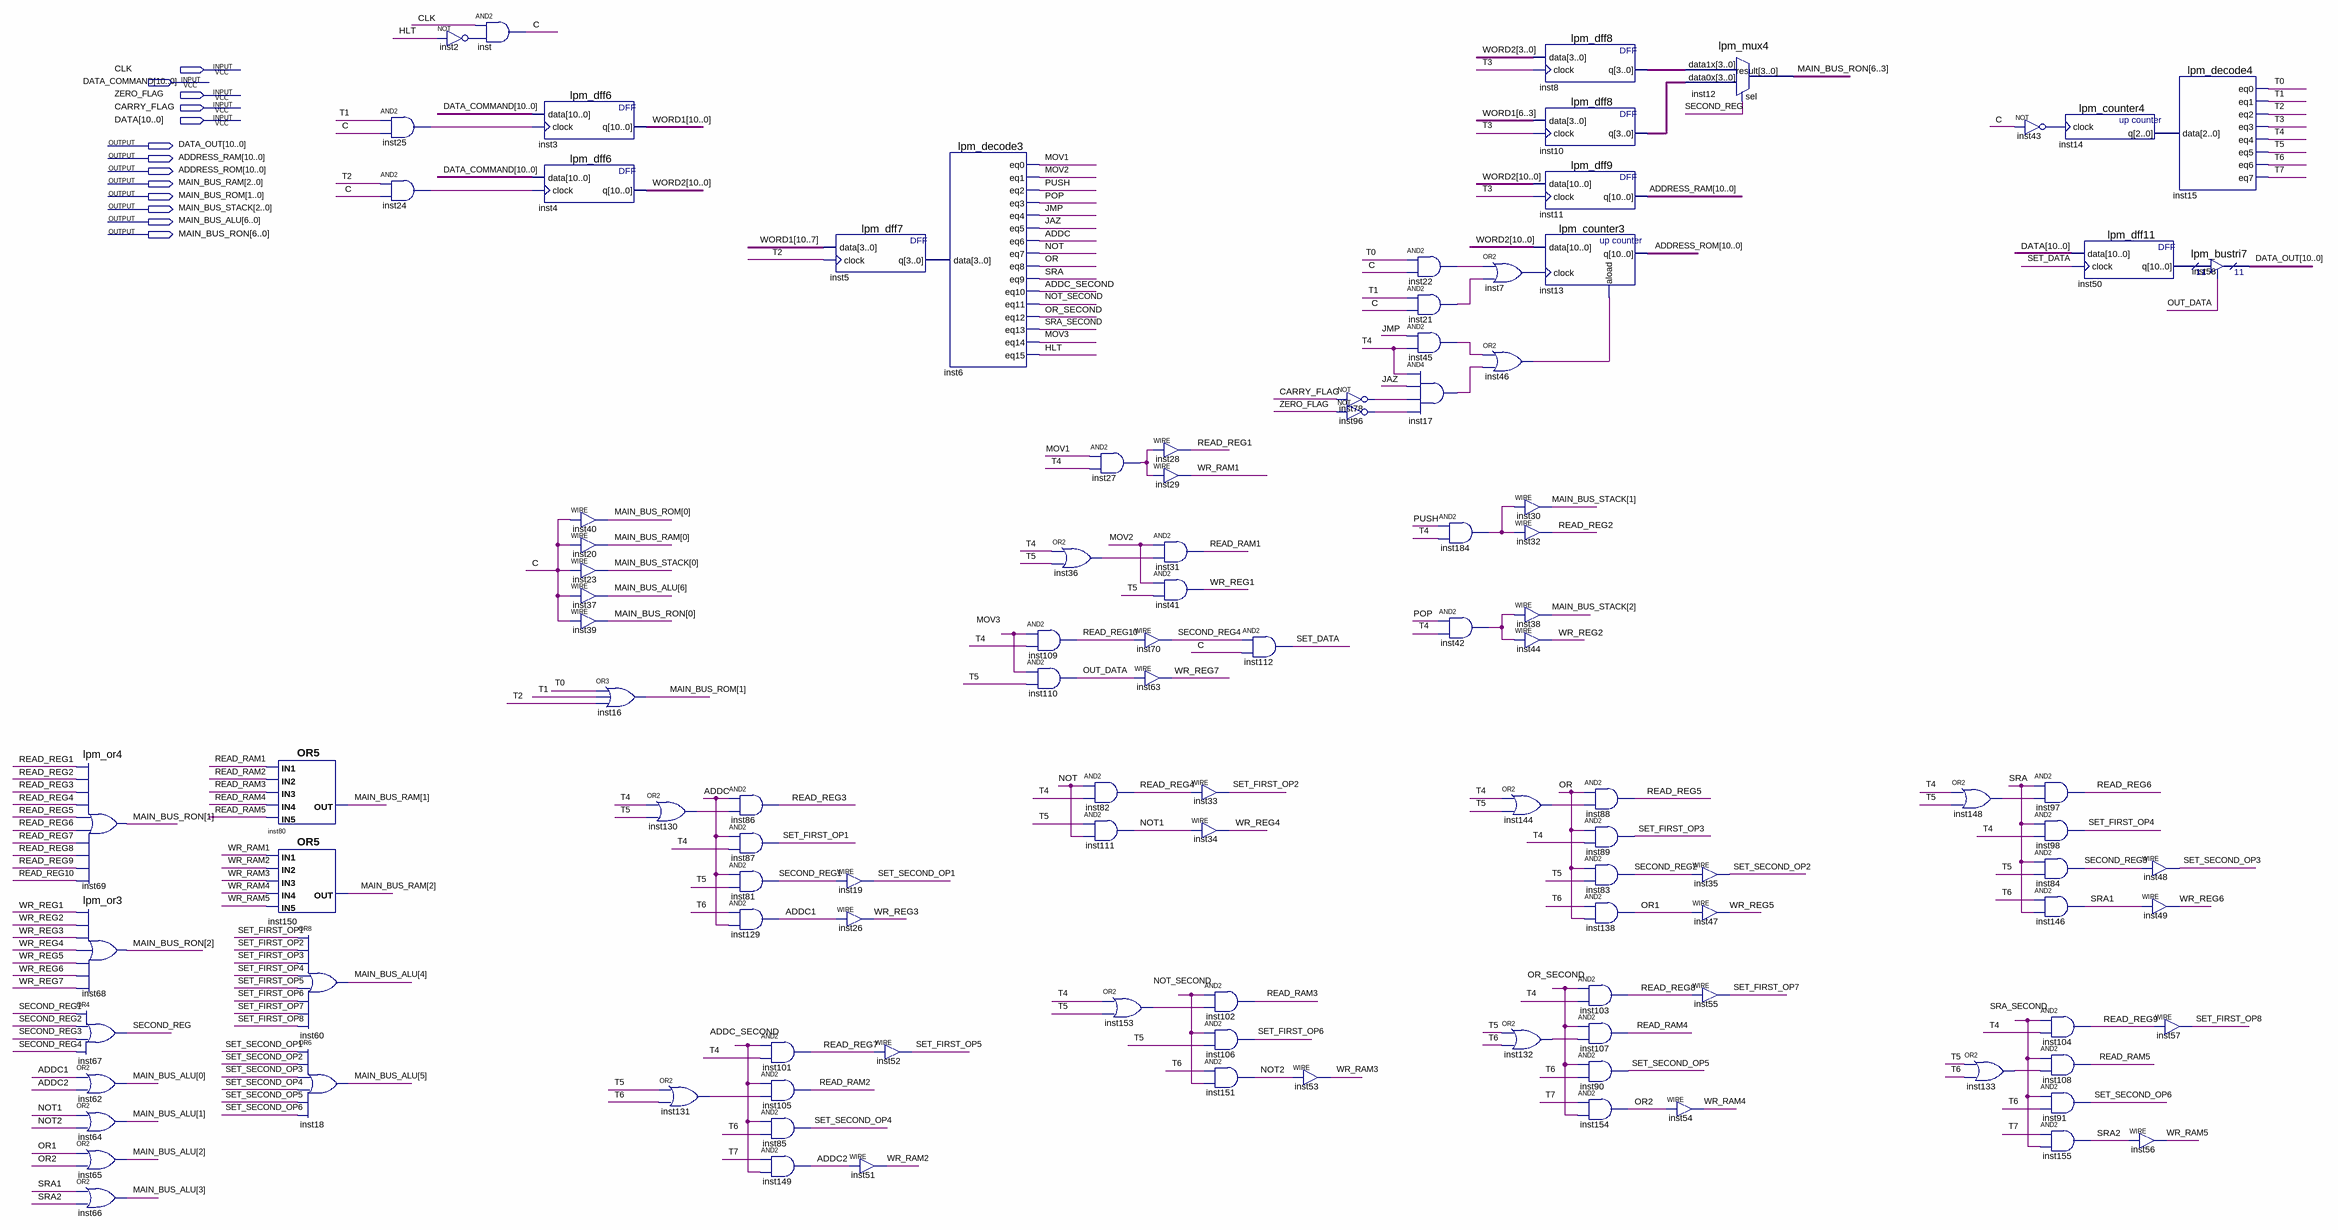
[diagram p0: schematic sheet]
// Quartus schematic CUBlock.bdf as structural Verilog: 111 symbols, 13 pins
module CUBlock (
  input  CLK,
  input  [10:0] DATA_COMMAND,
  input  ZERO_FLAG,
  input  CARRY_FLAG,
  input  [10:0] DATA,
  output [10:0] DATA_OUT,
  output [10:0] ADDRESS_RAM,
  output [10:0] ADDRESS_ROM,
  output [2:0] MAIN_BUS_RAM,
  output [1:0] MAIN_BUS_ROM,
  output [2:0] MAIN_BUS_STACK,
  output [6:0] MAIN_BUS_ALU,
  output [6:0] MAIN_BUS_RON
);

  wire ADDC, ADDC1, ADDC2, ADDC_SECOND, C, HLT, inst2_out, inst7_out, inst17_out, inst21_out, inst22_out,
       inst24_out, inst25_out, inst27_out, inst36_out, inst42_out, inst43_out, inst45_out, inst46_out,
       inst78_out, inst96_out, inst130_out, inst131_out, inst132_out, inst133_out, inst144_out, inst148_out,
       inst153_out, inst184_out, JAZ, JMP, MOV1, MOV2, MOV3, NOT, NOT1, NOT2, NOT_SECOND, OR, OR1, OR2,
       OR_SECOND, OUT_DATA, POP, PUSH, READ_RAM1, READ_RAM2, READ_RAM3, READ_RAM4, READ_RAM5, READ_REG1,
       READ_REG2, READ_REG3, READ_REG4, READ_REG5, READ_REG6, READ_REG7, READ_REG8, READ_REG9, READ_REG10,
       SECOND_REG, SECOND_REG1, SECOND_REG2, SECOND_REG3, SECOND_REG4, SET_DATA, SET_FIRST_OP1,
       SET_FIRST_OP2, SET_FIRST_OP3, SET_FIRST_OP4, SET_FIRST_OP5, SET_FIRST_OP6, SET_FIRST_OP7,
       SET_FIRST_OP8, SET_SECOND_OP1, SET_SECOND_OP2, SET_SECOND_OP3, SET_SECOND_OP4, SET_SECOND_OP5,
       SET_SECOND_OP6, SRA, SRA1, SRA2, SRA_SECOND, T0, T1, T2, T3, T4, T5, T6, T7, WR_RAM1, WR_RAM2,
       WR_RAM3, WR_RAM4, WR_RAM5, WR_REG1, WR_REG2, WR_REG3, WR_REG4, WR_REG5, WR_REG6, WR_REG7;
  wire [2:0] inst14_q;
  wire [3:0] inst5_q, inst8_q, inst10_q;
  wire [10:0] inst50_q, WORD1, WORD2;

  lpm_or4 inst69 (
    .data0(READ_REG1), .data1(READ_REG2), .data2(READ_REG3), .data3(READ_REG4), .data4(READ_REG5),
    .data5(READ_REG6), .data6(READ_REG7), .data7(READ_REG8), .data8(READ_REG9), .data9(READ_REG10),
    .result(MAIN_BUS_RON[1]));
  lpm_or3 inst68 (
    .data0(WR_REG1), .data1(WR_REG2), .data2(WR_REG3), .data3(WR_REG4), .data4(WR_REG5), .data5(WR_REG6),
    .data6(WR_REG7), .result(MAIN_BUS_RON[2]));
  or inst67 (SECOND_REG, SECOND_REG1, SECOND_REG2, SECOND_REG3, SECOND_REG4);
  or inst62 (MAIN_BUS_ALU[0], ADDC1, ADDC2);
  or inst64 (MAIN_BUS_ALU[1], NOT1, NOT2);
  or inst65 (MAIN_BUS_ALU[2], OR1, OR2);
  or inst66 (MAIN_BUS_ALU[3], SRA1, SRA2);
  or inst80 (MAIN_BUS_RAM[1], READ_RAM1, READ_RAM2, READ_RAM3, READ_RAM4, READ_RAM5);
  or inst150 (MAIN_BUS_RAM[2], WR_RAM1, WR_RAM2, WR_RAM3, WR_RAM4, WR_RAM5);
  or inst60 (MAIN_BUS_ALU[4], SET_FIRST_OP1, SET_FIRST_OP2, SET_FIRST_OP3, SET_FIRST_OP4, SET_FIRST_OP5, SET_FIRST_OP6, SET_FIRST_OP7, SET_FIRST_OP8);
  or inst18 (MAIN_BUS_ALU[5], SET_SECOND_OP1, SET_SECOND_OP2, SET_SECOND_OP3, SET_SECOND_OP4, SET_SECOND_OP5, SET_SECOND_OP6);
  and inst25 (inst25_out, T1, C);
  and inst24 (inst24_out, T2, C);
  not inst2 (inst2_out, HLT);
  and inst (C, CLK, inst2_out);
  lpm_dff6 inst3 (.data(DATA_COMMAND), .clock(inst25_out), .q(WORD1));
  lpm_dff6 inst4 (.data(DATA_COMMAND), .clock(inst24_out), .q(WORD2));
  assign MAIN_BUS_ROM[0] = C;  // WIRE inst40
  assign MAIN_BUS_RAM[0] = C;  // WIRE inst20
  assign MAIN_BUS_STACK[0] = C;  // WIRE inst23
  assign MAIN_BUS_ALU[6] = C;  // WIRE inst37
  assign MAIN_BUS_RON[0] = C;  // WIRE inst39
  or inst16 (MAIN_BUS_ROM[1], T0, T1, T2);
  or inst130 (inst130_out, T4, T5);
  or inst131 (inst131_out, T5, T6);
  and inst86 (READ_REG3, ADDC, inst130_out);
  and inst87 (SET_FIRST_OP1, ADDC, T4);
  and inst81 (SECOND_REG1, ADDC, T5);
  and inst129 (ADDC1, T6, ADDC);
  and inst101 (READ_REG7, ADDC_SECOND, T4);
  and inst105 (READ_RAM2, ADDC_SECOND, inst131_out);
  and inst85 (SET_SECOND_OP4, ADDC_SECOND, T6);
  and inst149 (ADDC2, T7, ADDC_SECOND);
  lpm_dff7 inst5 (.data(WORD1[10:7]), .clock(T2), .q(inst5_q));
  assign SET_SECOND_OP1 = SECOND_REG1;  // WIRE inst19
  assign WR_REG3 = ADDC1;  // WIRE inst26
  assign WR_RAM2 = ADDC2;  // WIRE inst51
  assign SET_FIRST_OP5 = READ_REG7;  // WIRE inst52
  lpm_decode3 inst6 (
    .data(inst5_q), .eq0(MOV1), .eq1(MOV2), .eq2(PUSH), .eq3(POP), .eq4(JMP), .eq5(JAZ), .eq6(ADDC),
    .eq7(NOT), .eq8(OR), .eq9(SRA), .eq10(ADDC_SECOND), .eq11(NOT_SECOND), .eq12(OR_SECOND),
    .eq13(SRA_SECOND), .eq14(MOV3), .eq15(HLT));
  or inst36 (inst36_out, T4, T5);
  and inst109 (READ_REG10, MOV3, T4);
  and inst110 (OUT_DATA, MOV3, T5);
  and inst27 (inst27_out, MOV1, T4);
  and inst82 (READ_REG4, NOT, T4);
  and inst111 (NOT1, T5, NOT);
  or inst153 (inst153_out, T4, T5);
  assign READ_REG1 = inst27_out;  // WIRE inst28
  assign WR_RAM1 = inst27_out;  // WIRE inst29
  and inst31 (READ_RAM1, MOV2, inst36_out);
  and inst41 (WR_REG1, MOV2, T5);
  assign SECOND_REG4 = READ_REG10;  // WIRE inst70
  assign WR_REG7 = OUT_DATA;  // WIRE inst63
  assign SET_FIRST_OP2 = READ_REG4;  // WIRE inst33
  assign WR_REG4 = NOT1;  // WIRE inst34
  and inst102 (READ_RAM3, NOT_SECOND, inst153_out);
  and inst106 (SET_FIRST_OP6, NOT_SECOND, T5);
  and inst151 (NOT2, T6, NOT_SECOND);
  and inst112 (SET_DATA, SECOND_REG4, C);
  assign WR_RAM3 = NOT2;  // WIRE inst53
  not inst78 (inst78_out, CARRY_FLAG);
  not inst96 (inst96_out, ZERO_FLAG);
  and inst22 (inst22_out, T0, C);
  and inst21 (inst21_out, T1, C);
  and inst45 (inst45_out, JMP, T4);
  and inst17 (inst17_out, T4, JAZ, inst78_out, inst96_out);
  and inst184 (inst184_out, PUSH, T4);
  and inst42 (inst42_out, POP, T4);
  or inst7 (inst7_out, inst22_out, inst21_out);
  or inst46 (inst46_out, inst45_out, inst17_out);
  or inst144 (inst144_out, T4, T5);
  or inst132 (inst132_out, T5, T6);
  lpm_dff8 inst8 (.data(WORD2[3:0]), .clock(T3), .q(inst8_q));
  lpm_dff8 inst10 (.data(WORD1[6:3]), .clock(T3), .q(inst10_q));
  lpm_dff9 inst11 (.data(WORD2), .clock(T3), .q(ADDRESS_RAM));
  lpm_counter3 inst13 (.data(WORD2), .clock(inst7_out), .aload(inst46_out), .q(ADDRESS_ROM));
  assign MAIN_BUS_STACK[1] = inst184_out;  // WIRE inst30
  assign READ_REG2 = inst184_out;  // WIRE inst32
  assign MAIN_BUS_STACK[2] = inst42_out;  // WIRE inst38
  assign WR_REG2 = inst42_out;  // WIRE inst44
  and inst88 (READ_REG5, OR, inst144_out);
  and inst89 (SET_FIRST_OP3, OR, T4);
  and inst83 (SECOND_REG2, OR, T5);
  and inst138 (OR1, T6, OR);
  and inst103 (READ_REG8, OR_SECOND, T4);
  and inst107 (READ_RAM4, OR_SECOND, inst132_out);
  and inst90 (SET_SECOND_OP5, OR_SECOND, T6);
  and inst154 (OR2, T7, OR_SECOND);
  lpm_mux4 inst12 (.data1x(inst8_q), .data0x(inst10_q), .sel(SECOND_REG), .result(MAIN_BUS_RON[6:3]));
  assign SET_SECOND_OP2 = SECOND_REG2;  // WIRE inst35
  assign WR_REG5 = OR1;  // WIRE inst47
  assign SET_FIRST_OP7 = READ_REG8;  // WIRE inst55
  assign WR_RAM4 = OR2;  // WIRE inst54
  or inst148 (inst148_out, T4, T5);
  or inst133 (inst133_out, T5, T6);
  not inst43 (inst43_out, C);
  lpm_counter4 inst14 (.clock(inst43_out), .q(inst14_q));
  and inst97 (READ_REG6, SRA, inst148_out);
  and inst98 (SET_FIRST_OP4, SRA, T4);
  and inst84 (SECOND_REG3, SRA, T5);
  and inst146 (SRA1, T6, SRA);
  and inst104 (READ_REG9, SRA_SECOND, T4);
  and inst108 (READ_RAM5, SRA_SECOND, inst133_out);
  and inst91 (SET_SECOND_OP6, SRA_SECOND, T6);
  and inst155 (SRA2, T7, SRA_SECOND);
  lpm_dff11 inst50 (.data(DATA), .clock(SET_DATA), .q(inst50_q));
  lpm_decode4 inst15 (.data(inst14_q), .eq0(T0), .eq1(T1), .eq2(T2), .eq3(T3), .eq4(T4), .eq5(T5), .eq6(T6), .eq7(T7));
  assign SET_SECOND_OP3 = SECOND_REG3;  // WIRE inst48
  assign WR_REG6 = SRA1;  // WIRE inst49
  assign SET_FIRST_OP8 = READ_REG9;  // WIRE inst57
  assign WR_RAM5 = SRA2;  // WIRE inst56
  lpm_bustri7 inst58 (.enabledt(OUT_DATA), .data(inst50_q), .tridata(DATA_OUT));
endmodule
